# Altium schematic sheet [6]-POTENTIOMETERS.SchDoc
size A3; SheetNumber: 7; SheetTotal: 8
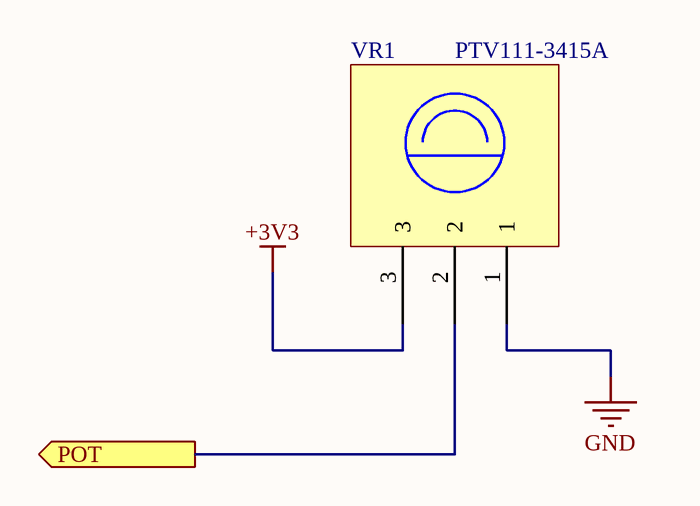
[diagram p0: [6]-POTENTIOMETERS.SchDoc]

## Parts
VR1  PTV111-3415A  [PTV111-3]

## Ports
POT (out)

## Nets
+3V3: VR1.3
GND: VR1.1
POT: VR1.2 ; port POT

## Library data of the parts
VR1 = PTV111-3415A-B103: POT 10K OHM 1/20W CARBON LINEAR; Manufacturer 1: Bourns; Resistance: 10kR; Tolerance: 20%; Power Rating: 50mW; Number of Turns: 1; Voltage Rating (DC): 20V; Actuator Length: 0.591inch; Actuator Diameter: 0.236inch; Hole Diameter: 9mm; Supplier 1: Digi-Key; Manufacturer Part Number 1: PTV111-3415A-B103; Stock 1: 227; Pricing 1: 1=1.36, 10=1.2, 25=1.08, 50=1.04, 100=1, 300=0.94, 500=0.8, 1000=0.74, 5000=0.608 (USD); Mount: Through Hole,Panel,Brackets; Min Operating Temperature: -10°C; Max Operating Temperature: 50°C; Composition: Potentiometer,Carbon; Type: Potentiometer; Packaging: Bulk; Package Quantity: 100; Taper: Linear; Termination: Pin; Number of Gangs: 1; Military Standard: Not; Max Power Dissipation: 50mW; Length: 12mm; Height: 7.5mm; Radiation Hardening: No; REACH SVHC: No SVHC; ComponentLink1URL: https://datasheet.ciiva.com/11831/0900766b80fa58ed-11831312.pdf; ComponentLink1Description: https://datasheet.ciiva.com/11831/0900766b80fa58ed-11831312.pdf; ComponentLink2URL: https://datasheet.ciiva.com/6249/ptvptt-6249367.pdf; ComponentLink2Description: https://datasheet.ciiva.com/6249/ptvptt-6249367.pdf; Supplier Part Number 1: PTV111-3415A-B103-ND